# Altium project HardwareMonitor.PrjPcb
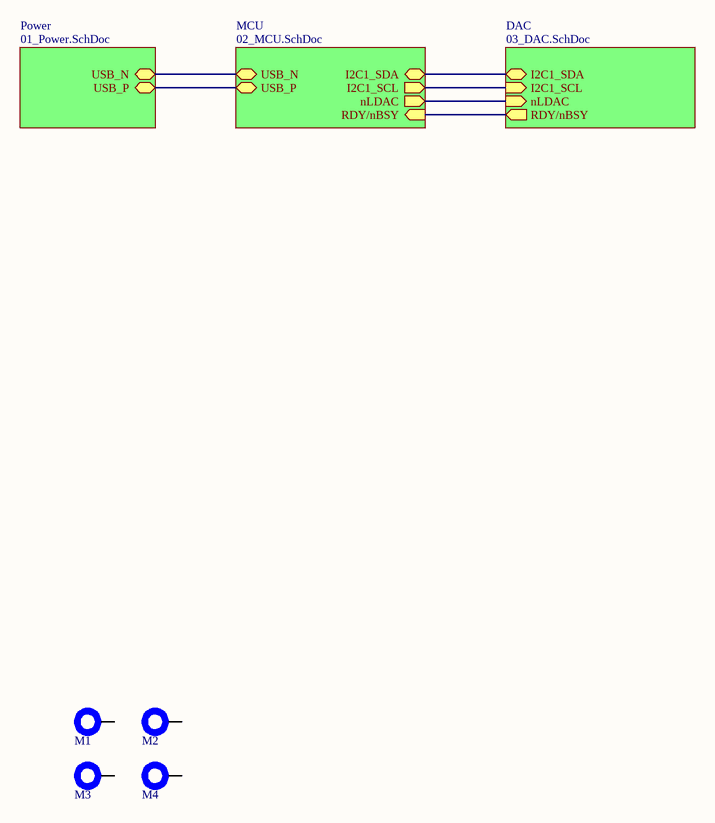
[diagram p0: 00_TOP.SchDoc]
4 sheets, 70 parts. Net scope: hierarchical (ports join the sheet entries above them; power ports are global).
Board file: PCB.PcbDoc
Sheets:
  00_TOP.SchDoc
    Power = 01_Power.SchDoc
    MCU = 02_MCU.SchDoc
    DAC = 03_DAC.SchDoc

## Sheet 00_TOP.SchDoc: Top Level Schematic
size A4; SheetNumber: 1; SheetTotal: 3; PageSetup: Record=PageOptions|CenterHorizontal=True|CenterVertical=True|PrintScale=1.09|XCorrection=1.00|YCorrection=1.00|PrintKind=0|BorderSize=5000000|LeftOffset=0|BottomOffset=0|Orientation=2|PaperLength=1000|PaperWidth=1000|Scale=100|PaperSource=7|PrintQuality=-3|MediaType=1|DitherType=10|PrintScaleMode=1|PaperKind=A4|PaperIndex=9; SK_ProjectName: Analog Resource Monitor; Version: R01

### Parts
M1  Mounting Hole  [Mounting Hole]  (value not drawn)
M2  Mounting Hole  [Mounting Hole]  (value not drawn)
M3  Mounting Hole  [Mounting Hole]  (value not drawn)
M4  Mounting Hole  [Mounting Hole]  (value not drawn)

### Sub-sheets
DAC = 03_DAC.SchDoc: I2C1_SCL (in), nLDAC (in), I2C1_SDA (bidir), RDY/nBSY (out)
MCU = 02_MCU.SchDoc: USB_N (bidir), USB_P (bidir), I2C1_SDA (bidir), I2C1_SCL (out), nLDAC (out), RDY/nBSY (in)
Power = 01_Power.SchDoc: USB_N (bidir), USB_P (bidir)

### Nets
I2C1_SCL: sheet MCU/I2C1_SCL, sheet DAC/I2C1_SCL
I2C1_SDA: sheet MCU/I2C1_SDA, sheet DAC/I2C1_SDA
nLDAC: sheet MCU/nLDAC, sheet DAC/nLDAC
RDY/nBSY: sheet MCU/RDY/nBSY, sheet DAC/RDY/nBSY
USB_N: sheet Power/USB_N, sheet MCU/USB_N
USB_P: sheet Power/USB_P, sheet MCU/USB_P

Not connected (* = marked no-connect by the designer): M1 0; M2 0; M3 0; M4 0

### Notes on the sheet
- Title:
- Project:
- Version:
- sasakaranovic.com
- Sasa Karanovic
- Project available at
- Date:
- Time:
- Sheet
- of

### Library data of the parts
M1-M4 = Mounting Hole: Board Mounting Hole

## Sheet 01_Power.SchDoc: Power
size A4; SheetNumber: 1; SheetTotal: 3; PageSetup: Record=PageOptions|CenterHorizontal=True|CenterVertical=True|PrintScale=1.09|XCorrection=1.00|YCorrection=1.00|PrintKind=0|BorderSize=5000000|LeftOffset=0|BottomOffset=0|Orientation=2|PaperLength=1000|PaperWidth=1000|Scale=100|PaperSource=7|PrintQuality=-3|MediaType=1|DitherType=10|PrintScaleMode=1|PaperKind=A4|PaperIndex=9; SK_ProjectName: Analog Resource Monitor; Version: R01
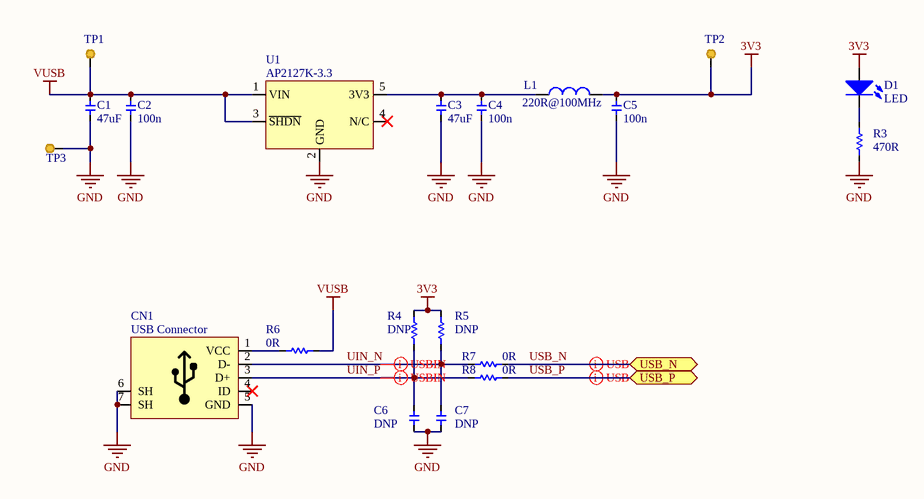
[diagram p1: 01_Power.SchDoc]

### Parts
C1  value 47uF  [0805]  (hidden comment: Cap)
C2  value 100n  [0603 - CAP]  (hidden comment: Cap)
C3  value 47uF  [0805]  (hidden comment: Cap)
C4  value 100n  [0603 - CAP]  (hidden comment: Cap)
C5  value 100n  [0603 - CAP]  (hidden comment: Cap)
C6  value DNP  [0603 - CAP]  (hidden comment: Cap)  (no BOM)
C7  value DNP  [0603 - CAP]  (hidden comment: Cap)  (no BOM)
CN1  USB Connector  [Amphenol FCI 10118192-0001LF]
D1  LED  [0603 Diode]
L1  value 220R@100MHz  [0603]  (hidden comment: Inductor)
R3  value 470R  [0603]  (hidden comment: Res)
R4  value DNP  [0603]  (hidden comment: Res)
R5  value DNP  [0603]  (hidden comment: Res)  (no BOM)
R6  value 0R  [0603]  (hidden comment: Res)
R7  value 0R  [0603]  (hidden comment: Res)
R8  value 0R  [0603]  (hidden comment: Res)
TP1  Test Point 0.6mm  [TP_SMD_1mm]  (value not drawn)  (no BOM)
TP2  Test Point 0.6mm  [TP_SMD_1mm]  (value not drawn)  (no BOM)
TP3  Test Point 0.6mm  [TP_SMD_1mm]  (value not drawn)  (no BOM)
U1  AP2127K-3.3  [SOT-23-5]

### Ports
USB_N (bidir), USB_P (bidir)

### Nets
3V3: C5.2 D1.A L1.2 R4.1 R5.1 TP2.1
GND: C1.1 C2.1 C3.1 C4.1 C5.1 C6.1 C7.1 CN1.5(GND) CN1.6(SH) CN1.7(SH) R3.2 TP3.1 U1.2(GND)
VUSB: C1.2 C2.2 R6.1 TP1.1 U1.1(VIN) U1.3(~{SHDN})
UIN_N: C7.2 CN1.2(D-) R5.2 R7.2
UIN_P: C6.2 CN1.3(D+) R4.2 R8.2
USB_N: R7.1 ; port USB_N
USB_P: R8.1 ; port USB_P
NetC3_2: C3.2 C4.2 L1.1 U1.5(3V3)
NetCN1_1: CN1.1(VCC) R6.2
NetD1_K: D1.K R3.1

Not connected (* = marked no-connect by the designer): CN1 4(ID)*; U1 4(N/C)*

### Layout directives
differential pair: UIN_N, UIN_P, USB_N, USB_P

### Notes on the sheet
- Title:
- Project:
- Version:
- sasakaranovic.com
- Sasa Karanovic
- Project available at
- Date:
- Time:
- Sheet
- of

### Library data of the parts
C1 C3 = Cap: CAP TANT POLY47UF 20% 16V 1210; Manufacturer: AVX Corporation; Manufacturer Part Number: TCNT476M016R0200A; Distributor Part Number: 478-9595-1-ND; Distributor: DigiKey
C2 C4-C7 = Cap: Capacitor; Manufacturer: AVX Corporation; Manufacturer Part Number: 06035C104KAT2A; Distributor Part Number: 478-5052-1-ND; Distributor: DigiKey
CN1 = Amphenol FCI 10118192-0001LF: CONN USB MICRO B RECPT SMT R/A; Distributor: DigiKey; Manufacturer: Amphenol FCI; Distributor Part Number: 609-4613-1-ND; Manufacturer Part Number: 10118192-0001LF
D1 = LED: Typical RED GaAs LED; Distributor: DigiKey
L1 = Inductor: FERRITE BEAD 220 OHM 0603 1LN; Manufacturer: Murata Electronics North America; Manufacturer Part Number: BLM18KG221SN1D; Distributor: DigiKey; Distributor Part Number: 490-5255-1-ND
R3 = Res: Resistor; Manufacturer: Yageo; Manufacturer Part Number: RC0603FR-07470RL; Distributor: DigiKey; Distributor Part Number: 311-470HRCT-ND
R4-R8 = Res: Resistor; Manufacturer: Yageo; Manufacturer Part Number: RC0603JR-070RL; Distributor: DigiKey; Distributor Part Number: 311-0.0GRCT-ND
TP1-TP3 = TP
U1 = AP2127K-3.3TRG1: IC REG LINEAR 3.3V 300MA SOT23-5; Manufacturer: Diodes Incorporated; Distributor: DigiKey; Distributor Part Number: AP2127K-3.3TRG1DICT-ND; Manufacturer Part Number: AP2127K-3.3TRG1

## Sheet 02_MCU.SchDoc: MCU
size A4; SheetNumber: 1; SheetTotal: 3; PageSetup: Record=PageOptions|CenterHorizontal=True|CenterVertical=True|PrintScale=1.09|XCorrection=1.00|YCorrection=1.00|PrintKind=0|BorderSize=5000000|LeftOffset=0|BottomOffset=0|Orientation=2|PaperLength=1000|PaperWidth=1000|Scale=100|PaperSource=7|PrintQuality=-3|MediaType=1|DitherType=10|PrintScaleMode=1|PaperKind=A4|PaperIndex=9; SK_ProjectName: Analog Resource Monitor; Version: R01
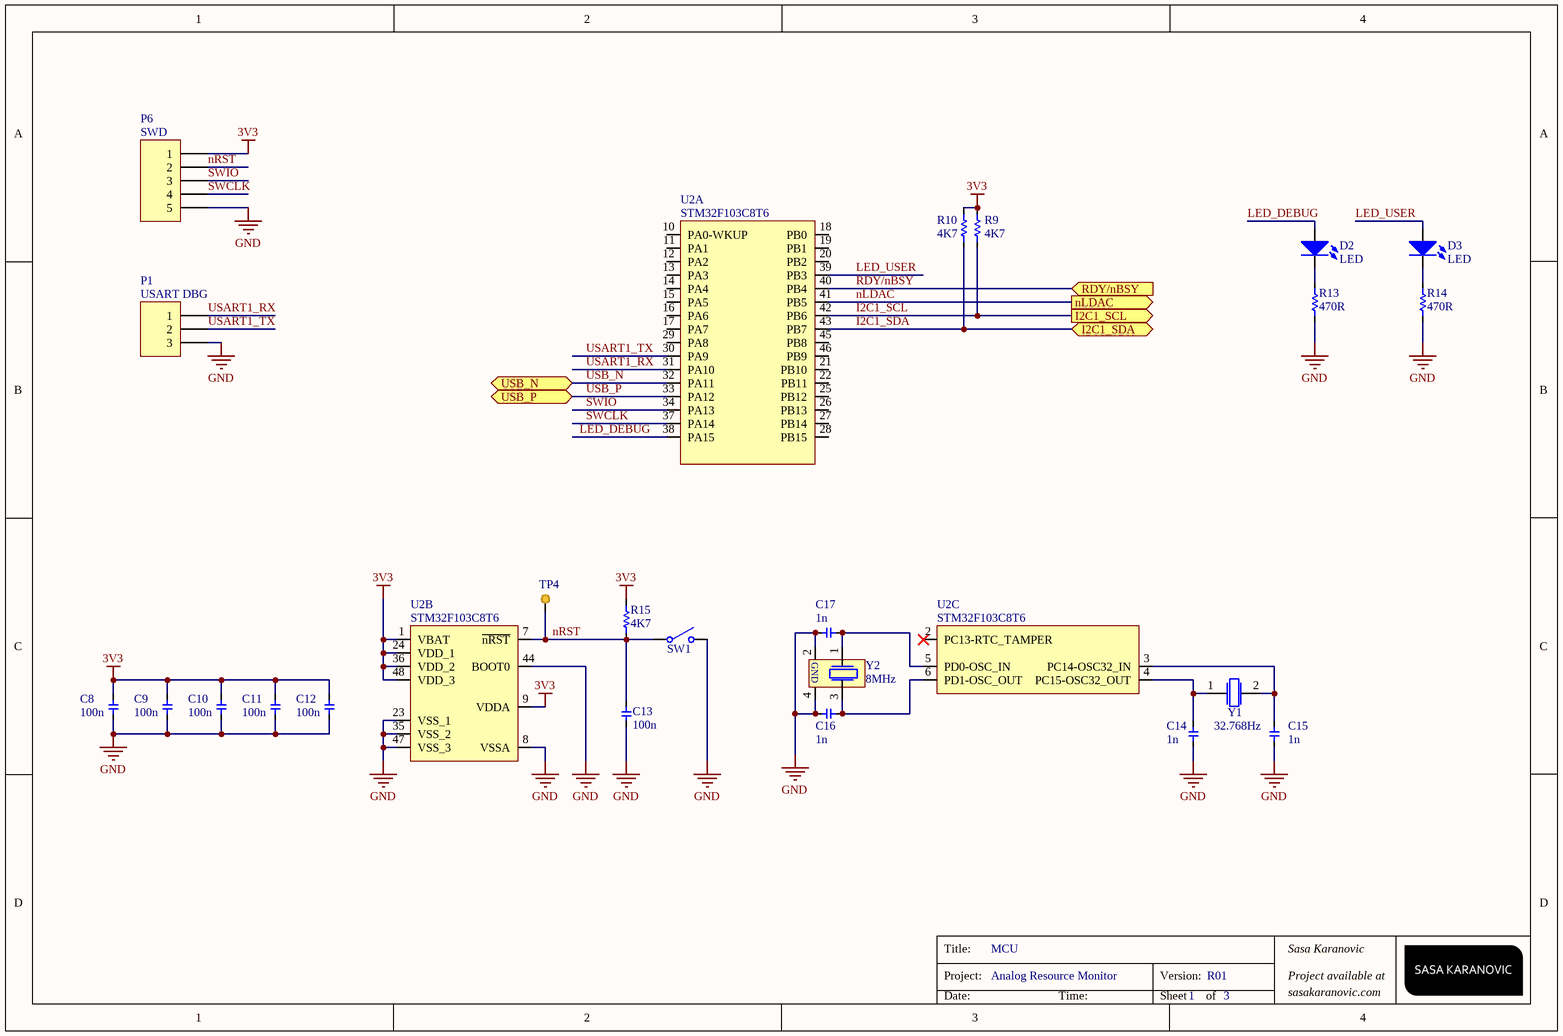
[diagram p2: 02_MCU.SchDoc]

### Parts
C8  value 100n  [0603 - CAP]  (hidden comment: Cap)
C9  value 100n  [0603 - CAP]  (hidden comment: Cap)
C10  value 100n  [0603 - CAP]  (hidden comment: Cap)
C11  value 100n  [0603 - CAP]  (hidden comment: Cap)
C12  value 100n  [0603 - CAP]  (hidden comment: Cap)
C13  value 100n  [0603 - CAP]  (hidden comment: Cap)
C14  value 1n  [0603 - CAP]  (hidden comment: Cap)
C15  value 1n  [0603 - CAP]  (hidden comment: Cap)
C16  value 1n  [0603 - CAP]  (hidden comment: Cap)
C17  value 1n  [0603 - CAP]  (hidden comment: Cap)
D2  LED  [0603 Diode]
D3  LED  [0603 Diode]
P1  USART DBG  [Header 3x1 SMD]
P6  SWD  [Header 5x1 SMD]
R9  value 4K7  [0603]  (hidden comment: Res)
R10  value 4K7  [0603]  (hidden comment: Res)
R13  value 470R  [0603]  (hidden comment: Res)
R14  value 470R  [0603]  (hidden comment: Res)
R15  value 4K7  [0603]  (hidden comment: Res)
SW1  Switch  [EVQ-5PN04K]  (value not drawn)
TP4  Test Point 0.6mm  [TP_SMD_1mm]  (value not drawn)  (no BOM)
U2  STM32F103C8T6  [LQFP48_7x7mm]  (parts A,B,C of 3)
Y1  32.768Hz  [ABS07-120]
Y2  8MHz  [ABM8G]

### Ports
I2C1_SCL (out), I2C1_SDA (bidir), nLDAC (out), RDY/nBSY (in), USB_N (bidir), USB_P (bidir)

### Nets
3V3: C8.2 C9.2 C10.2 C11.2 C12.2 P6.1 R9.1 R10.1 R15.1 U2.1(VBAT) U2.9(VDDA) U2.24(VDD_1) U2.36(VDD_2) U2.48(VDD_3)
GND: C8.1 C9.1 C10.1 C11.1 C12.1 C13.1 C14.1 C15.1 C16.2 C17.2 P1.3 P6.5 R13.2 R14.2 SW1.2(COMMON2) U2.8(VSSA) U2.23(VSS_1) U2.35(VSS_2) U2.44(BOOT0) U2.47(VSS_3) Y2.2(OSC2) Y2.4(OSC4)
I2C1_SCL: R9.2 U2.42(PB6) ; port I2C1_SCL
I2C1_SDA: R10.2 U2.43(PB7) ; port I2C1_SDA
LED_DEBUG: D2.A U2.38(PA15)
LED_USER: D3.A U2.39(PB3)
nLDAC: U2.41(PB5) ; port nLDAC
nRST: C13.2 P6.2 R15.2 SW1.1(COMMON1) TP4.1 U2.7(~{nRST})
RDY/nBSY: U2.40(PB4) ; port RDY/nBSY
SWCLK: P6.4 U2.37(PA14)
SWIO: P6.3 U2.34(PA13)
USART1_RX: P1.1 U2.31(PA10)
USART1_TX: P1.2 U2.30(PA9)
USB_N: U2.32(PA11) ; port USB_N
USB_P: U2.33(PA12) ; port USB_P
NetC14_2: C14.2 U2.4(PC15-OSC32_OUT) Y1.1(OSC1)
NetC15_2: C15.2 U2.3(PC14-OSC32_IN) Y1.2(OSC2)
NetC16_1: C16.1 U2.6(PD1-OSC_OUT) Y2.3(OSC3)
NetC17_1: C17.1 U2.5(PD0-OSC_IN) Y2.1(OSC1)
NetD2_K: D2.K R13.1
NetD3_K: D3.K R14.1

Not connected (* = marked no-connect by the designer): U2 2(PC13-RTC_TAMPER)* 10(PA0-WKUP) 11(PA1) 12(PA2) 13(PA3) 14(PA4) 15(PA5) 16(PA6) 17(PA7) 18(PB0) 19(PB1) 20(PB2) 21(PB10) 22(PB11) 25(PB12) 26(PB13) 27(PB14) 28(PB15) 29(PA8) 45(PB8) 46(PB9)

### Notes on the sheet
- Title:
- Project:
- Version:
- sasakaranovic.com
- Sasa Karanovic
- Project available at
- Date:
- Time:
- Sheet
- of
- (in symbol ABM8G) GND

### Library data of the parts
C8-C13 = Cap: as C2 on sheet 01_Power; Distributor Part Number: 478-5052-1-ND; Distributor: DigiKey
C14-C17 = Cap: Capacitor; Distributor: DigiKey
D2 D3 = LED: Typical RED GaAs LED
P1 = Header 3: Header, 3-Pin
P6 = Header 5: Header, 5-Pin
R9 R10 R15 = Res: as R4 on sheet 01_Power; Distributor: DigiKey; Distributor Part Number: 311-0.0GRCT-ND
R13 R14 = Res: as R3 on sheet 01_Power; Distributor: DigiKey; Distributor Part Number: 311-470HRCT-ND
SW1 = EVQ-5PN04K: SWITCH TACTILE SPST-NO 0.05A 12V; Manufacturer: Panasonic Electronic Components; Distributor: DigiKey; Distributor Part Number: P13595SCT-ND; Manufacturer Part Number: EVQ-5PN04K
TP4 = TP
U2 = STM32F103C8T6: IC MCU 32BIT 64KB FLASH 48LQFP; Manufacturer: STMicroelectronics; Distributor: DigiKey; Distributor Part Number: 497-6063-ND; Manufacturer Part Number: STM32F103C8T6
Y1 = ABS07-120-32.768KHZ-T: CRYSTAL 32.7680KHZ 6PF SMD; Manufacturer: Abracon LLC; Distributor: DigiKey; Distributor Part Number: 535-11937-1-ND; Manufacturer Part Number: ABS07-120-32.768KHZ-T
Y2 = ABM8G: CRYSTAL 16.0000MHZ 10PF SMD; Manufacturer: Abracon LLC; Manufacturer Part Number: ABM8G-16.000MHZ-4Y-T3; Distributor: DigiKey; Distributor Part Number: 535-10907-1-ND

## Sheet 03_DAC.SchDoc: Digital-to-Analog Converter
size A4; SheetNumber: 1; SheetTotal: 3; PageSetup: Record=PageOptions|CenterHorizontal=True|CenterVertical=True|PrintScale=1.09|XCorrection=1.00|YCorrection=1.00|PrintKind=0|BorderSize=5000000|LeftOffset=0|BottomOffset=0|Orientation=2|PaperLength=1000|PaperWidth=1000|Scale=100|PaperSource=7|PrintQuality=-3|MediaType=1|DitherType=10|PrintScaleMode=1|PaperKind=A4|PaperIndex=9; SK_ProjectName: Analog Resource Monitor; Version: R01
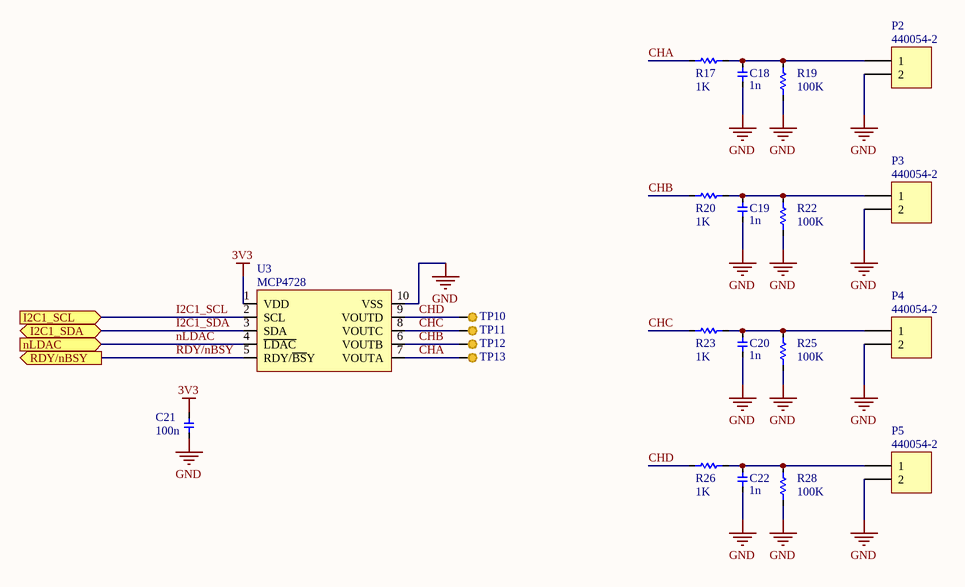
[diagram p3: 03_DAC.SchDoc]

### Parts
C18  value 1n  [0603 - CAP]  (hidden comment: Cap)
C19  value 1n  [0603 - CAP]  (hidden comment: Cap)
C20  value 1n  [0603 - CAP]  (hidden comment: Cap)
C21  value 100n  [0603 - CAP]  (hidden comment: Cap)
C22  value 1n  [0603 - CAP]  (hidden comment: Cap)
P2  440054-2  [HEADER-2mm-2Pos]
P3  440054-2  [HEADER-2mm-2Pos]
P4  440054-2  [HEADER-2mm-2Pos]
P5  440054-2  [HEADER-2mm-2Pos]
R17  value 1K  [0603]  (hidden comment: Res)
R19  value 100K  [0603]  (hidden comment: Res)
R20  value 1K  [0603]  (hidden comment: Res)
R22  value 100K  [0603]  (hidden comment: Res)
R23  value 1K  [0603]  (hidden comment: Res)
R25  value 100K  [0603]  (hidden comment: Res)
R26  value 1K  [0603]  (hidden comment: Res)
R28  value 100K  [0603]  (hidden comment: Res)
TP10  Test Point 0.6mm  [TP_SMD_1mm]  (value not drawn)  (no BOM)
TP11  Test Point 0.6mm  [TP_SMD_1mm]  (value not drawn)  (no BOM)
TP12  Test Point 0.6mm  [TP_SMD_1mm]  (value not drawn)  (no BOM)
TP13  Test Point 0.6mm  [TP_SMD_1mm]  (value not drawn)  (no BOM)
U3  MCP4728  [TSSOP50P490X110-10N]

### Ports
I2C1_SCL (in), I2C1_SDA (bidir), nLDAC (in), RDY/nBSY (out)

### Nets
3V3: C21.2 U3.1(VDD)
GND: C18.1 C19.1 C20.1 C21.1 C22.1 P2.2 P3.2 P4.2 P5.2 R19.1 R22.1 R25.1 R28.1 U3.10(VSS)
CHA: R17.1 TP13.1 U3.7(VOUTA)
CHB: R20.1 TP12.1 U3.6(VOUTB)
CHC: R23.1 TP11.1 U3.8(VOUTC)
CHD: R26.1 TP10.1 U3.9(VOUTD)
I2C1_SCL: U3.2(SCL) ; port I2C1_SCL
I2C1_SDA: U3.3(SDA) ; port I2C1_SDA
nLDAC: U3.4(~{LDAC}) ; port nLDAC
RDY/nBSY: U3.5(RDY/~{BS}Y) ; port RDY/nBSY
NetC18_2: C18.2 P2.1 R17.2 R19.2
NetC19_2: C19.2 P3.1 R20.2 R22.2
NetC20_2: C20.2 P4.1 R23.2 R25.2
NetC22_2: C22.2 P5.1 R26.2 R28.2

### Notes on the sheet
- Title:
- Project:
- Version:
- sasakaranovic.com
- Sasa Karanovic
- Project available at
- Date:
- Time:
- Sheet
- of

### Library data of the parts
C18-C20 C22 = Cap: Capacitor; Distributor: DigiKey
C21 = Cap: as C2 on sheet 01_Power; Distributor Part Number: 478-5052-1-ND; Distributor: DigiKey
P2-P5 = 440054-2: CONN HEADER VERT 2POS 2MM; Manufacturer: TE Connectivity AMP Connectors; Manufacturer Part Number: 440054-2; Distributor: DigiKey
R17 R20 R23 R26 = Res: Resistor; Distributor: DigiKey
R19 R22 R25 R28 = Res: Resistor; Manufacturer: Yageo; Manufacturer Part Number: RC0603FR-07100KL; Distributor: DigiKey; Distributor Part Number: 311-100KHRCT-ND
TP10-TP13 = TP
U3 = MCP4728: IC DAC 12BIT W/I2C 10-MSOP; Manufacturer: Microchip Technology; Manufacturer Part Number: MCP4728T-E/UN; Distributor: DigiKey; Distributor Part Number: MCP4728T-E/UNCT-ND

## Nets that join several sheets
3V3: 01_Power (6 pins), 02_MCU (14 pins), 03_DAC (C21.2 U3.1)
GND: 01_Power (13 pins), 02_MCU (22 pins), 03_DAC (14 pins)
I2C1_SCL: 02_MCU (R9.2 U2.42), 03_DAC (U3.2)
I2C1_SDA: 02_MCU (R10.2 U2.43), 03_DAC (U3.3)
nLDAC: 02_MCU (U2.41), 03_DAC (U3.4)
RDY/nBSY: 02_MCU (U2.40), 03_DAC (U3.5)
USB_N: 01_Power (R7.1), 02_MCU (U2.32)
USB_P: 01_Power (R8.1), 02_MCU (U2.33)